# EAGLE schematic STM32f407layout_nonintegrated (EAGLE 7.5.0)
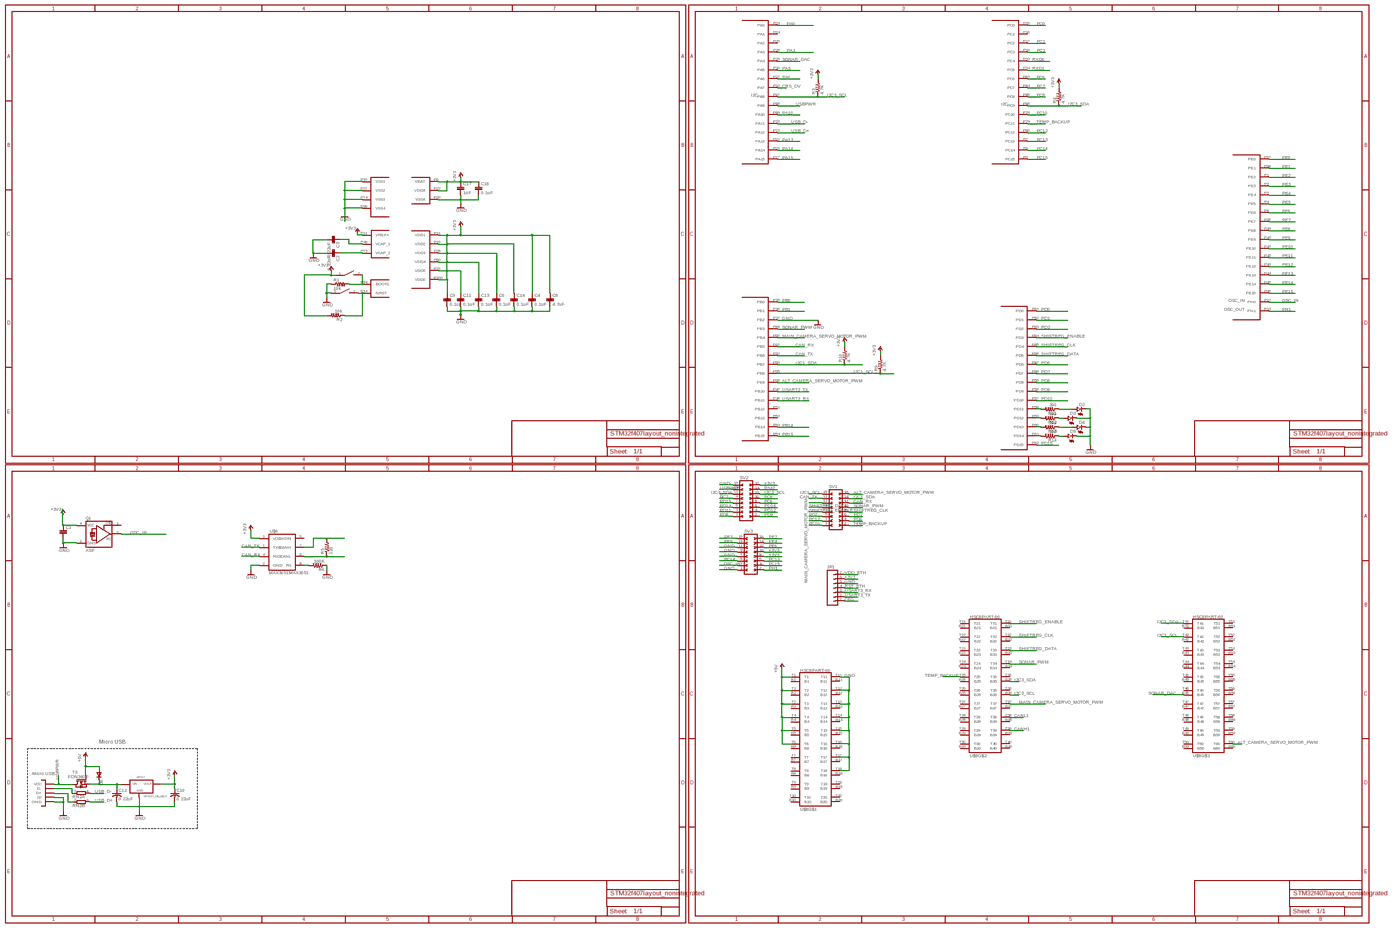
[diagram p0: schematic, sheet 1, overview]
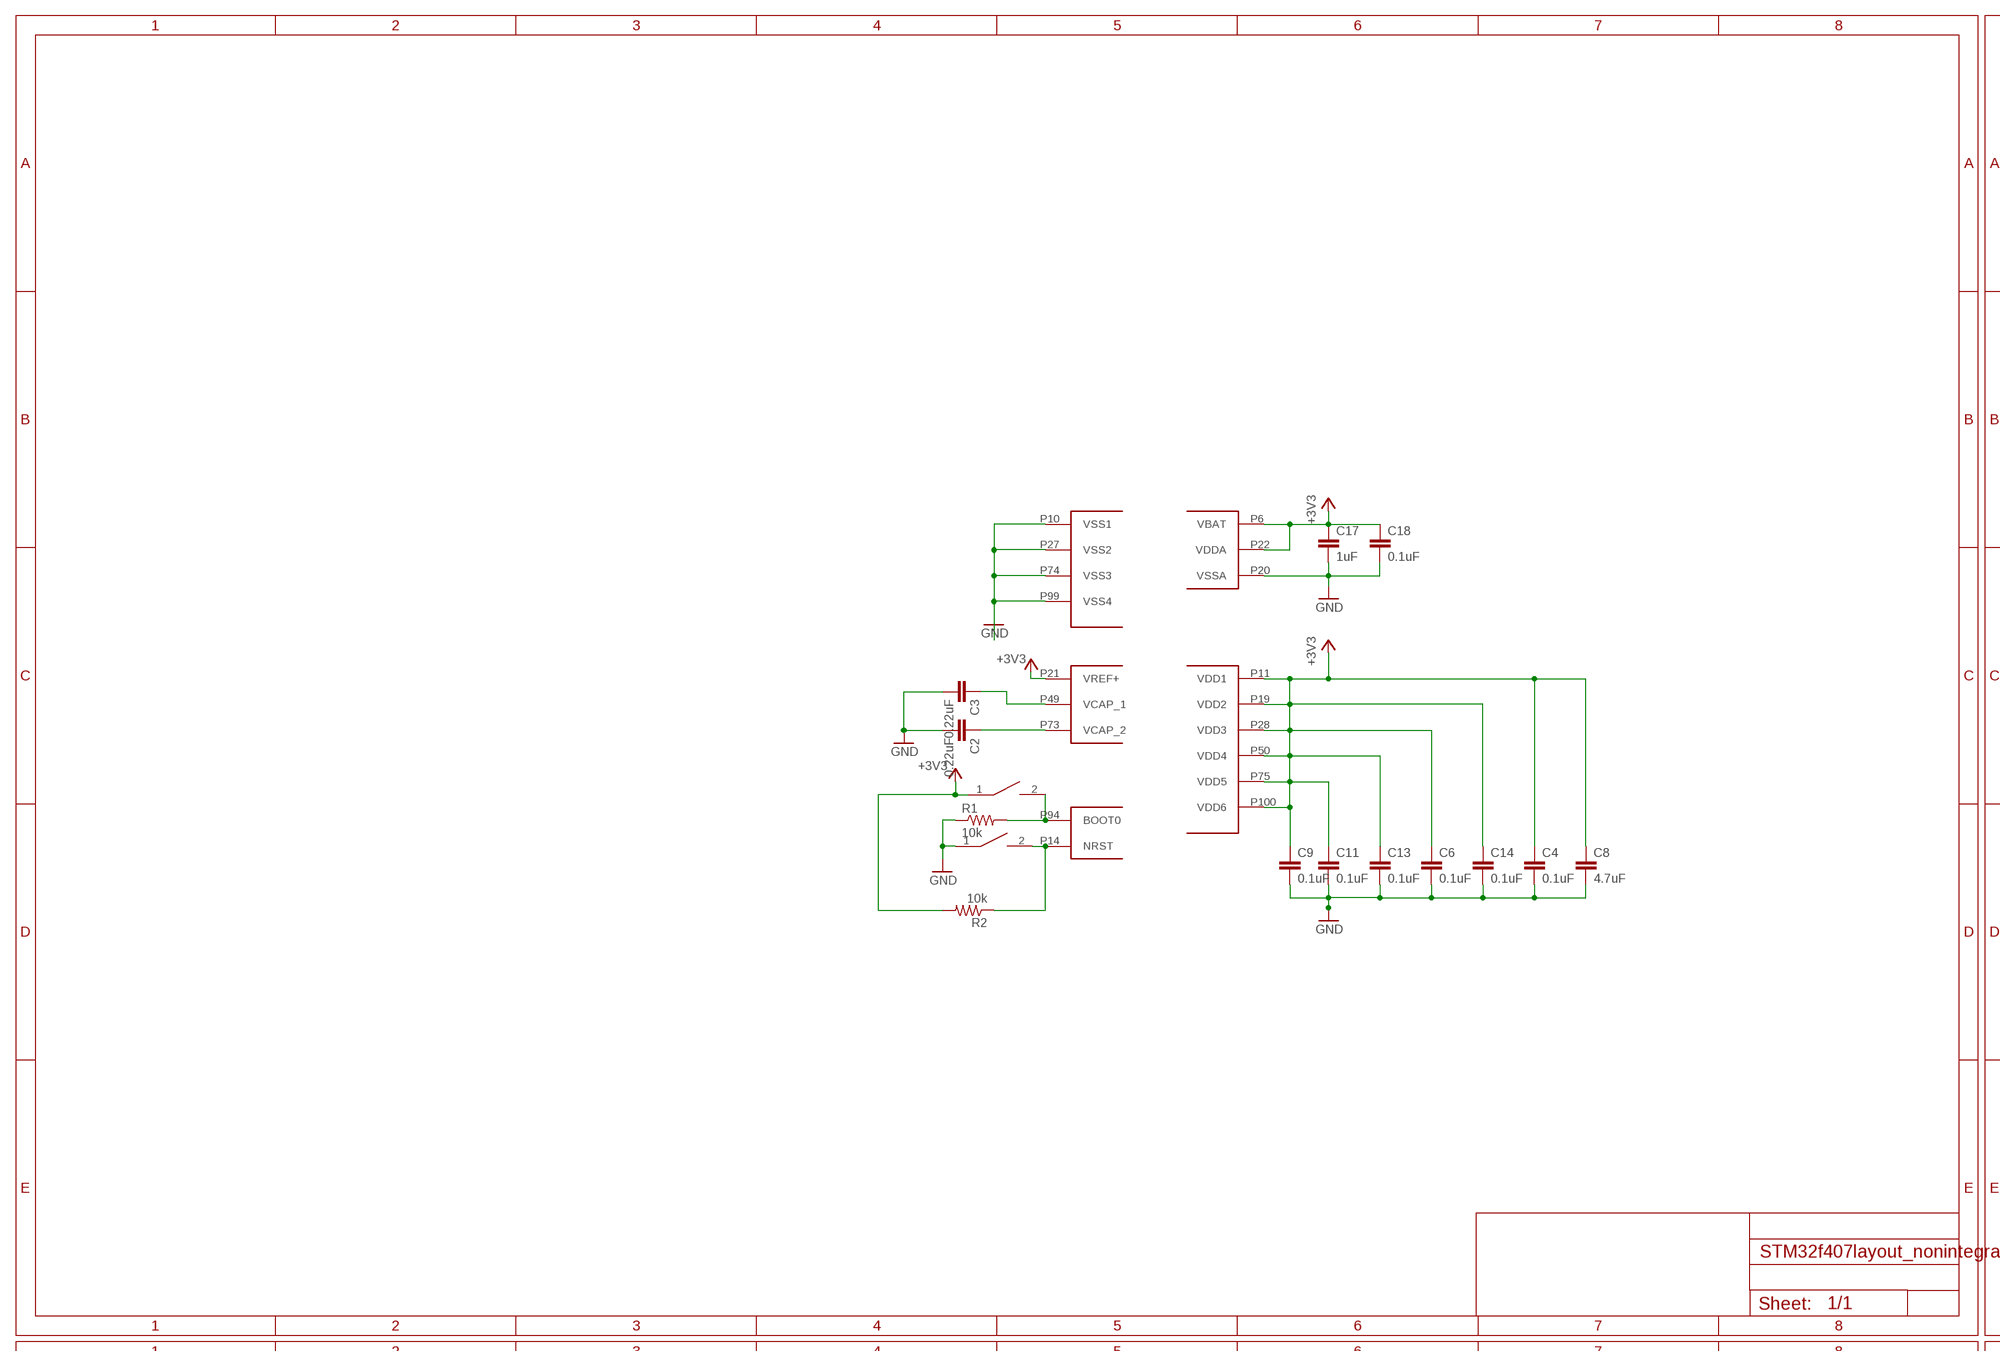
[diagram p1: schematic, sheet 1, part 1 of 4]
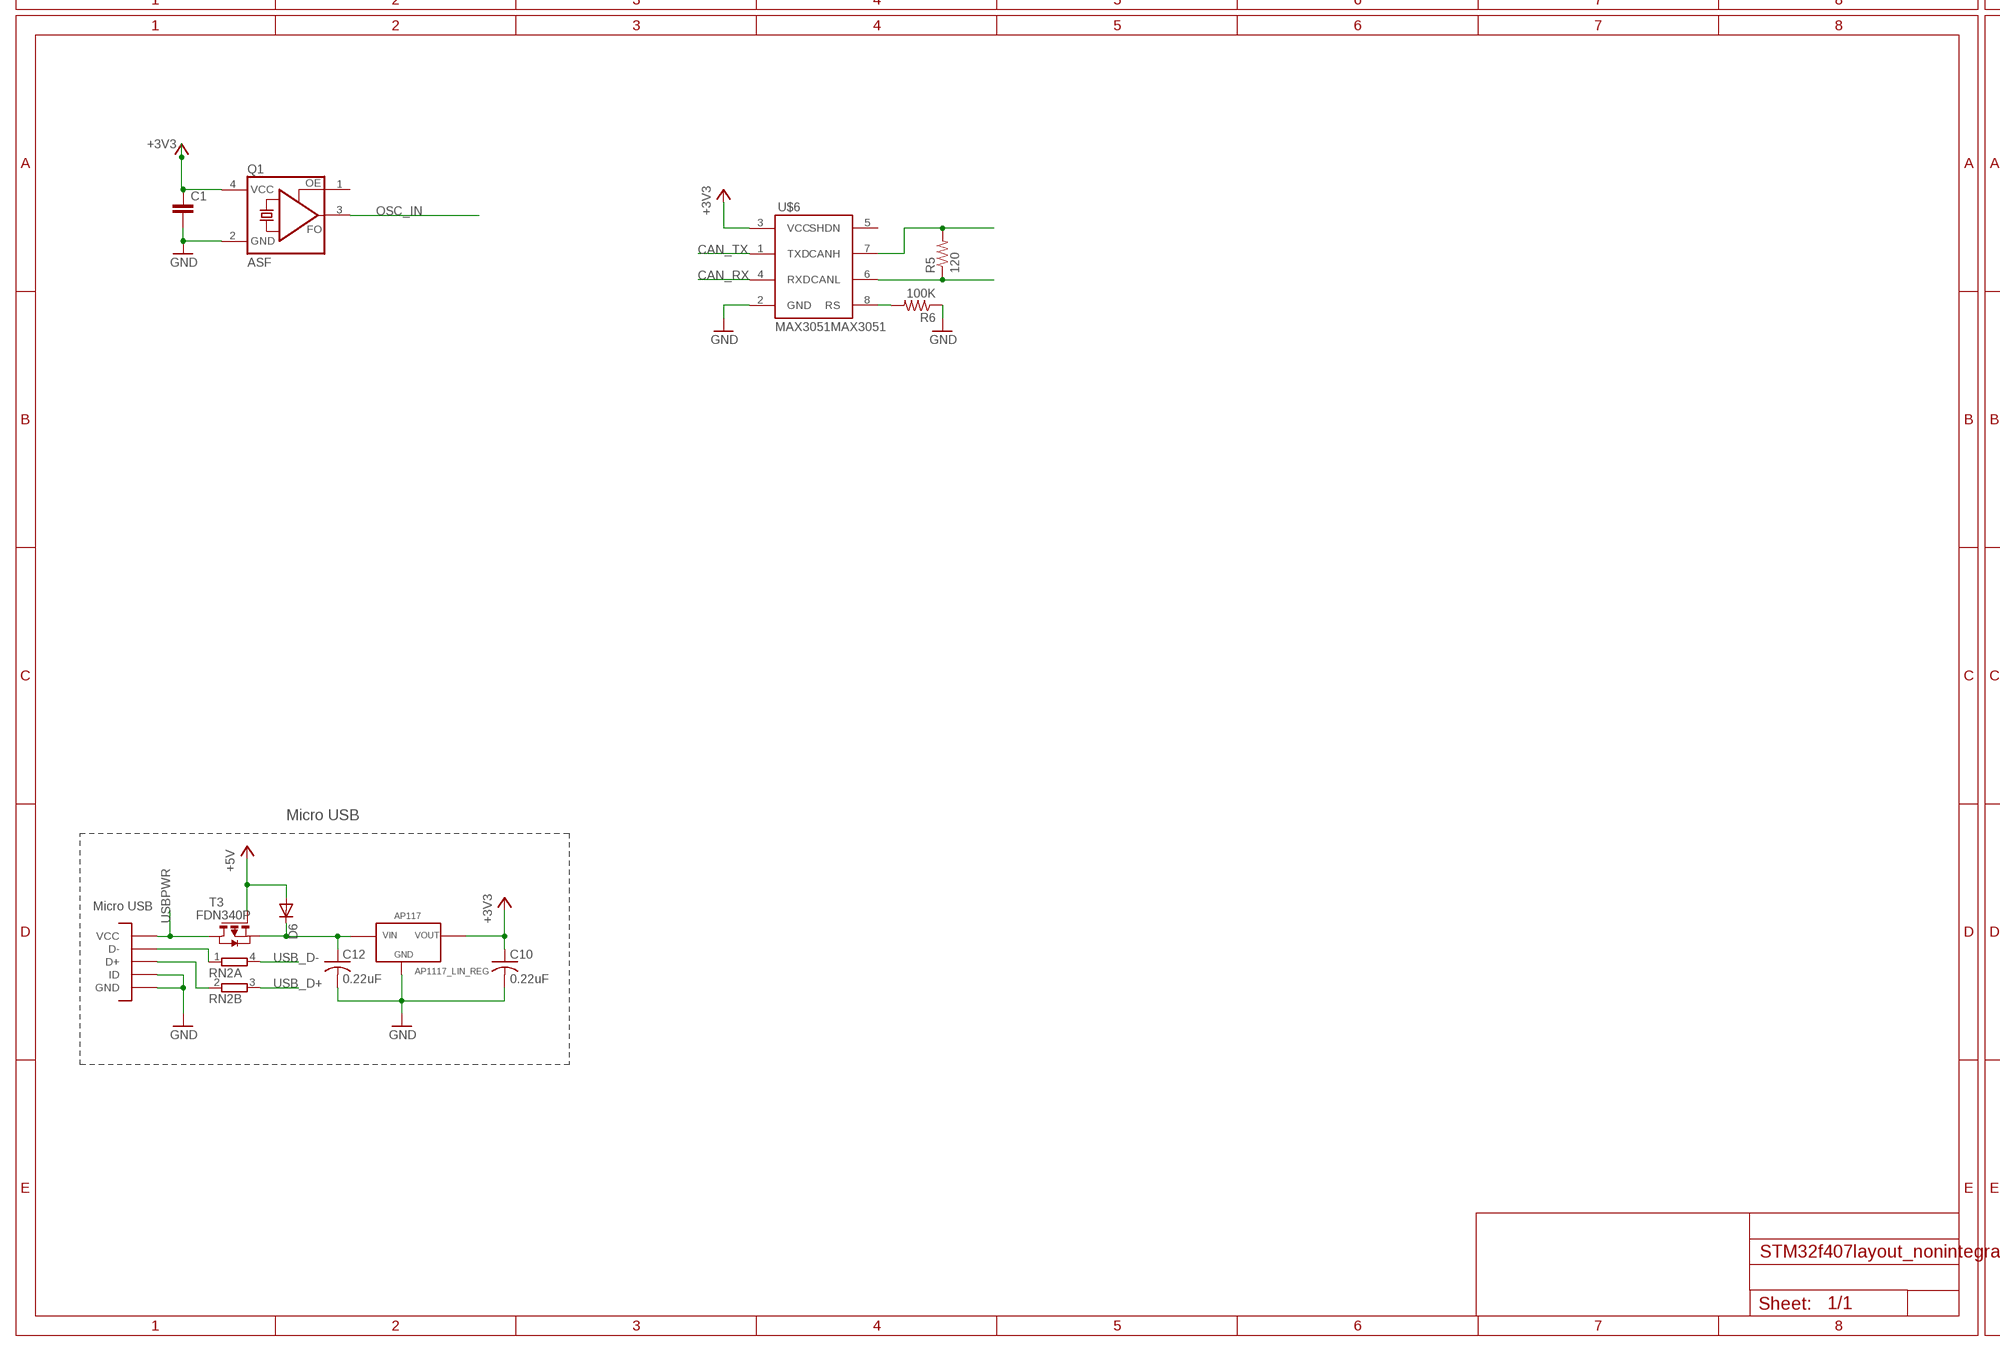
[diagram p2: schematic, sheet 1, part 2 of 4]
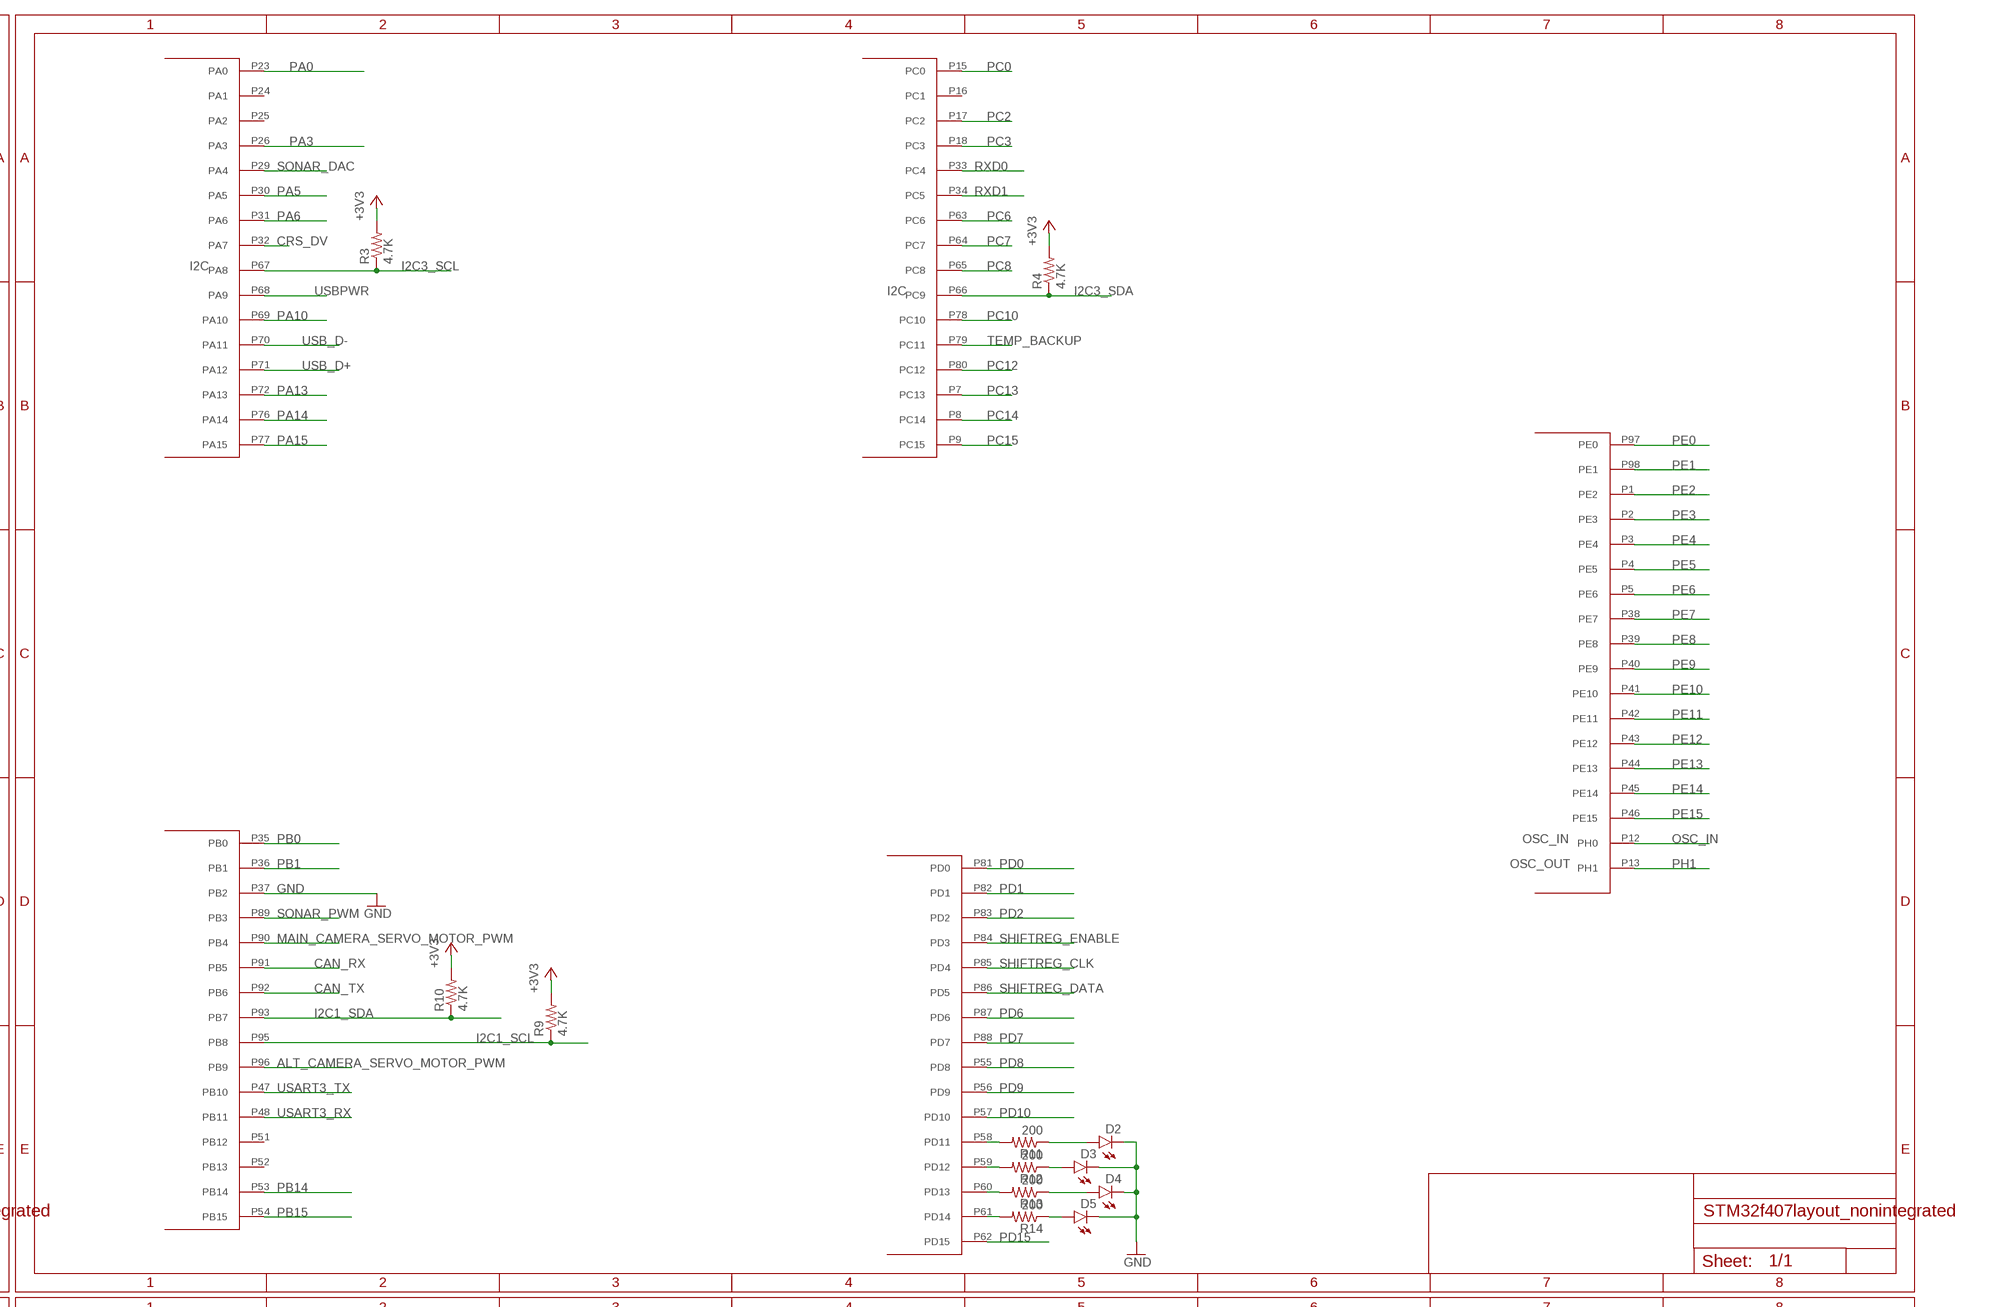
[diagram p3: schematic, sheet 1, part 3 of 4]
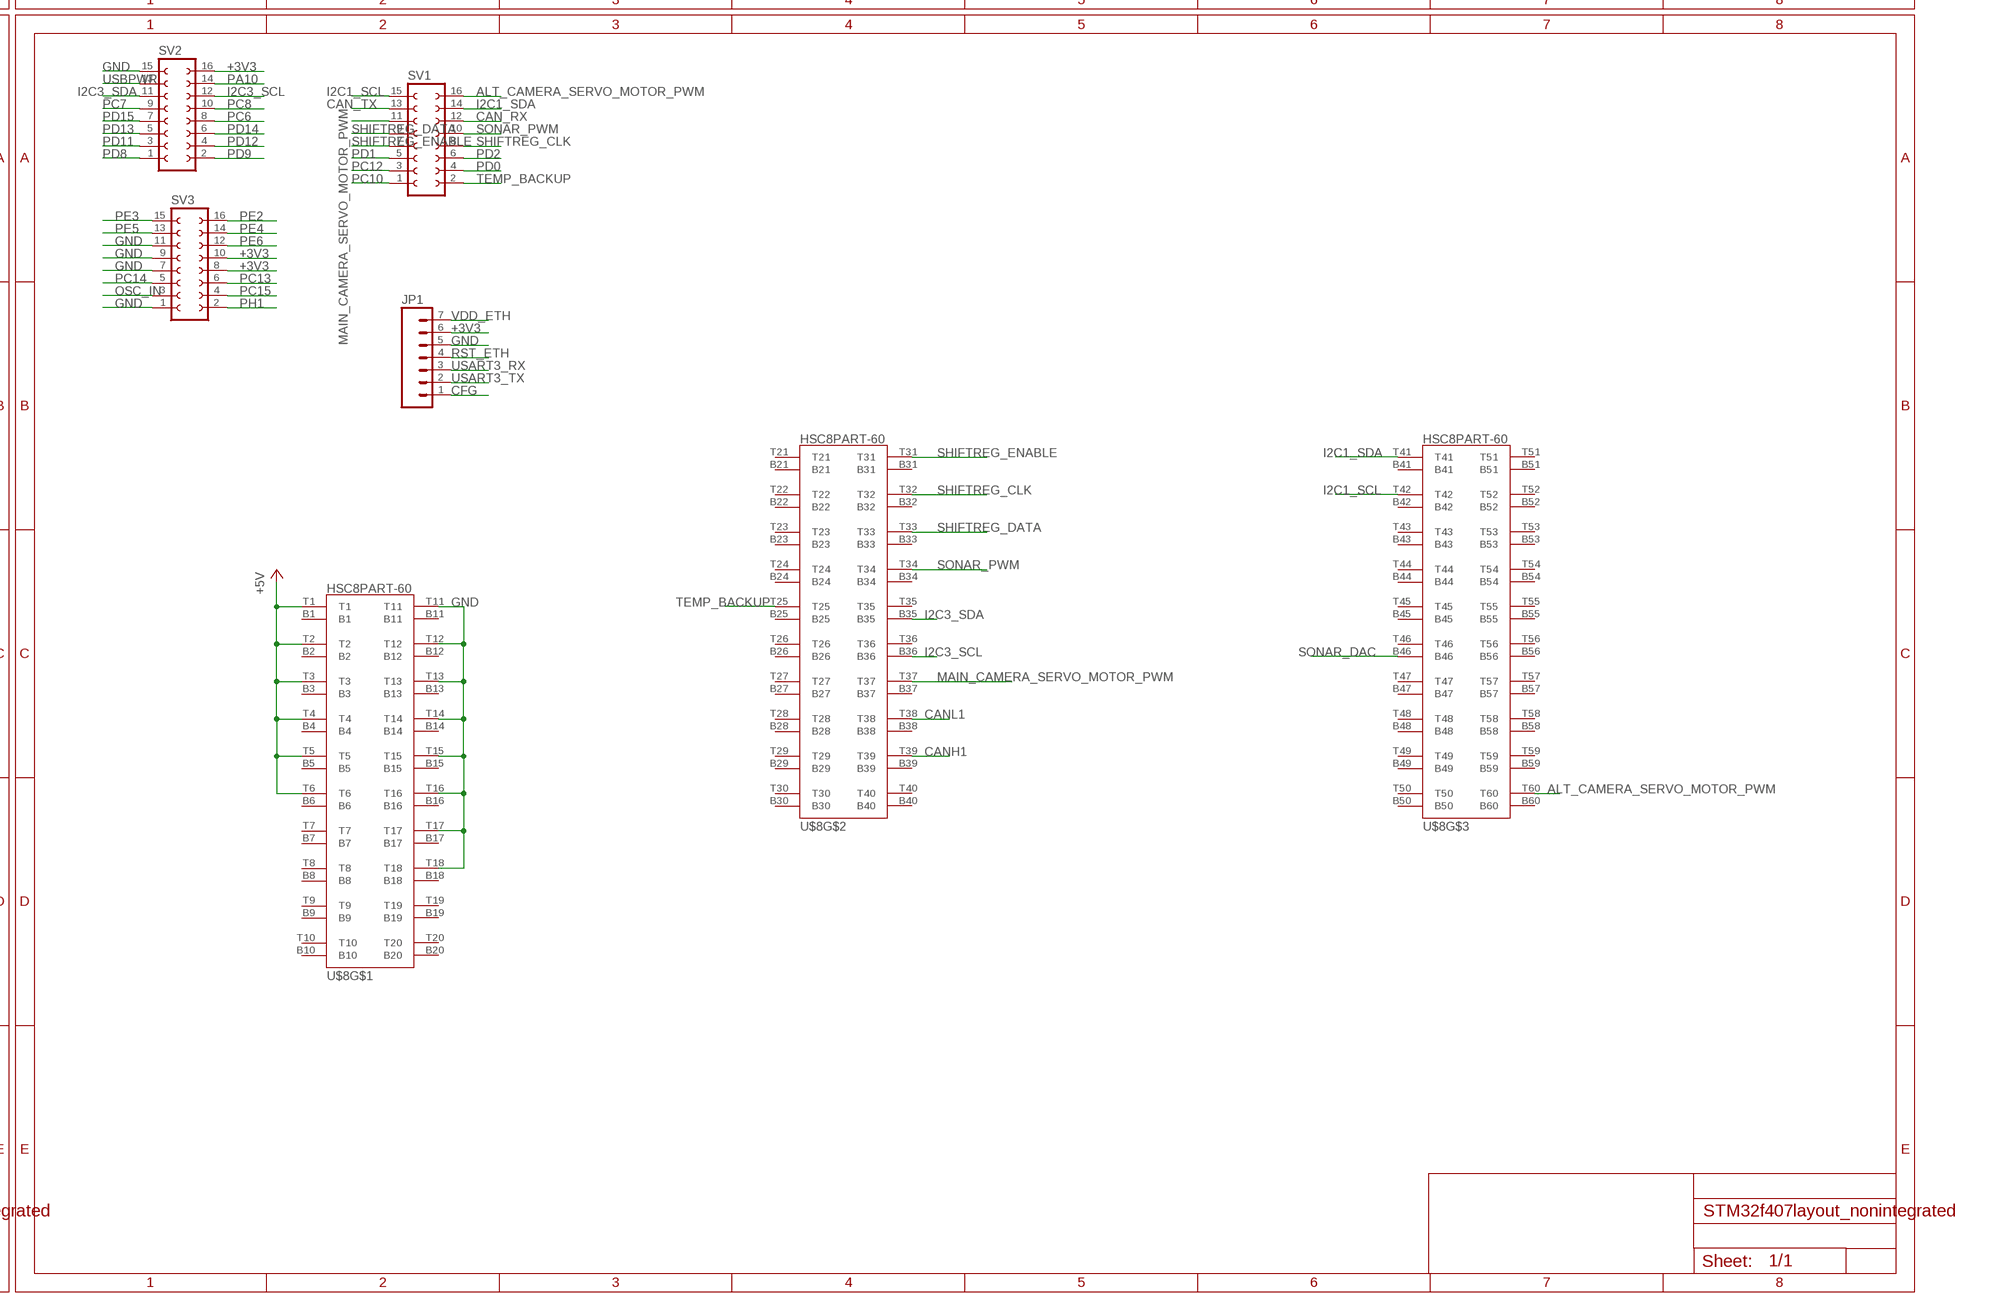
[diagram p4: schematic, sheet 1, part 4 of 4]

## Parts
C1  CAP0603-CAP  [0603-CAP]
C2  0.22uF  CAP0603-CAP  [0603-CAP]
C3  0.22uF  CAP0603-CAP  [0603-CAP]
C4  0.1uF  CAP0603-CAP  [0603-CAP]
C6  0.1uF  CAP0603-CAP  [0603-CAP]
C8  4.7uF  CAP0603-CAP  [0603-CAP]
C9  0.1uF  CAP0603-CAP  [0603-CAP]
C10  0.22uF  C-USC0603  [C0603]
C11  0.1uF  CAP0603-CAP  [0603-CAP]
C12  0.22uF  C-USC0603  [C0603]
C13  0.1uF  CAP0603-CAP  [0603-CAP]
C14  0.1uF  CAP0603-CAP  [0603-CAP]
C17  1uF  CAP0603-CAP  [0603-CAP]
C18  0.1uF  CAP0603-CAP  [0603-CAP]
D2  LED0603  [LED-0603]
D3  LED0603  [LED-0603]
D4  LED0603  [LED-0603]
D5  LED0603  [LED-0603]
D6  DIODE-DO-214AC  [DO-214AC]
JP1  M07  [1X07]
Q1  ASF  [ASF]
R1  10k  RESISTOR0603-RES  [0603-RES]
R2  10k  RESISTOR0603-RES  [0603-RES]
R3  4.7K  RESISTOR0603-RES  [0603-RES]
R4  4.7K  RESISTOR0603-RES  [0603-RES]
R5  120  RESISTOR0603-RES  [0603-RES]
R6  100K  RESISTOR0603-RES  [0603-RES]
R9  4.7K  RESISTOR0603-RES  [0603-RES]
R10  4.7K  RESISTOR0603-RES  [0603-RES]
R11  200  RESISTOR0603-RES  [0603-RES]
R12  200  RESISTOR0603-RES  [0603-RES]
R13  200  RESISTOR0603-RES  [0603-RES]
R14  200  RESISTOR0603-RES  [0603-RES]
RN2  2R-NEXBV4V  [EXBV4V]
SV1  FE08-2  [FE08-2]
SV2  FE08-2  [FE08-2]
SV3  FE08-2  [FE08-2]
T3  FDN340P  [SOT-23]
T4  AP1117_LIN_REG  [SOT223]
U$1  STM32F4  [LQFP100]
U$2  SWITCH  [SW_2512]
U$3  SWITCH  [SW_2512]
U$5  MICROUSB  [MICRO_B]
U$6  MAX3051MAX3051  [SOT23-8L]
U$8  HSC8PART-60  [HSC8-60PINOUUT]

## Nets
+3V3: C1.1 C4.1 C6.1 C8.1 C9.1 C10.1 C11.1 C13.1 C14.1 C17.1 C18.1 JP1.6 Q1.4(VCC) R2.2 R3.2 R4.2 R9.2 R10.2 SV2.16 SV3.8 SV3.10 T4.TAB(VOUT) T4.VOUT U$1.P6(VBAT) U$1.P11(VDD1) U$1.P19(VDD2) U$1.P21(VREF+) U$1.P22(VDDA) U$1.P28(VDD3) U$1.P50(VDD4) U$1.P75(VDD5) U$1.P100(VDD6) U$3.1 U$6.3(VCC)
+5V: D6.A T3.3(G) U$8.T1 U$8.T2 U$8.T3 U$8.T4 U$8.T5 U$8.T6
ALT_CAMERA_SERVO_MOTOR_PWM: SV1.16 U$1.P96(PB9) U$8.T60
CAN_RX: SV1.12 U$1.P91(PB5) U$6.4(RXD)
CAN_TX: SV1.13 U$1.P92(PB6) U$6.1(TXD)
CANH1: R5.2 U$6.7(CANH) U$8.T39
CANL1: R5.1 U$6.6(CANL) U$8.T38
CFG: JP1.1
CRS_DV: U$1.P32(PA7)
GND: C1.2 C2.2 C3.2 C4.2 C6.2 C8.2 C9.2 C10.2 C11.2 C12.2 C13.2 C14.2 C17.2 C18.2 D2.C D3.C D4.C D5.C JP1.5 Q1.2(GND) R1.1 R6.1 SV2.15 SV3.1 SV3.7 SV3.9 SV3.11 T4.GND U$1.P10(VSS1) U$1.P20(VSSA) U$1.P27(VSS2) U$1.P37(PB2) U$1.P74(VSS3) U$1.P99(VSS4) U$2.1 U$5.GND1(GND) U$5.GND2(GND) U$5.GND3(GND) U$5.GND4(GND) U$5.GND7(GND) U$5.GND8(GND) U$5.P4(ID) U$5.P5(GND) U$6.2(GND) U$8.T11 U$8.T12 U$8.T13 U$8.T14 U$8.T15 U$8.T16 U$8.T17 U$8.T18
I2C1_SCL: R9.1 SV1.15 U$1.P95(PB8) U$8.T42
I2C1_SDA: R10.1 SV1.14 U$1.P93(PB7) U$8.T41
I2C3_SCL: R3.1 SV2.12 U$1.P67(PA8) U$8.B36
I2C3_SDA: R4.1 SV2.11 U$1.P66(PC9) U$8.B35
MAIN_CAMERA_SERVO_MOTOR_PWM: SV1.11 U$1.P90(PB4) U$8.T37
N$1: C2.1 U$1.P73(VCAP_2)
N$2: C3.1 U$1.P49(VCAP_1)
N$3: R1.2 U$1.P94(BOOT0) U$3.2
N$4: R2.1 U$1.P14(NRST) U$2.2
N$11: R6.2 U$6.8(RS)
N$12: RN2.1 U$5.P2(D-)
N$14: D3.A R12.1
N$15: D5.A R14.1
N$17: D4.A R13.1
N$18: D2.A R11.1
N$24: RN2.2 U$5.P3(D+)
N$58: C12.1 D6.C T3.2(S) T4.VIN
OSC_IN: Q1.3(FO) SV3.3 U$1.P12(PH0)
PA0: U$1.P23(PA0)
PA3: U$1.P26(PA3)
PA5: U$1.P30(PA5)
PA6: U$1.P31(PA6)
PA10: SV2.14 U$1.P69(PA10)
PA13: U$1.P72(PA13)
PA14: U$1.P76(PA14)
PA15: U$1.P77(PA15)
PB0: U$1.P35(PB0)
PB1: U$1.P36(PB1)
PB14: U$1.P53(PB14)
PB15: U$1.P54(PB15)
PC0: U$1.P15(PC0)
PC2: U$1.P17(PC2)
PC3: U$1.P18(PC3)
PC6: SV2.8 U$1.P63(PC6)
PC7: SV2.9 U$1.P64(PC7)
PC8: SV2.10 U$1.P65(PC8)
PC10: SV1.1 U$1.P78(PC10)
PC12: SV1.3 U$1.P80(PC12)
PC13: SV3.6 U$1.P7(PC13)
PC14: SV3.5 U$1.P8(PC14)
PC15: SV3.4 U$1.P9(PC15)
PD0: SV1.4 U$1.P81(PD0)
PD1: SV1.5 U$1.P82(PD1)
PD2: SV1.6 U$1.P83(PD2)
PD6: U$1.P87(PD6)
PD7: U$1.P88(PD7)
PD8: SV2.1 U$1.P55(PD8)
PD9: SV2.2 U$1.P56(PD9)
PD10: U$1.P57(PD10)
PD11: R11.2 SV2.3 U$1.P58(PD11)
PD12: R12.2 SV2.4 U$1.P59(PD12)
PD13: R13.2 SV2.5 U$1.P60(PD13)
PD14: R14.2 SV2.6 U$1.P61(PD14)
PD15: SV2.7 U$1.P62(PD15)
PE0: U$1.P97(PE0)
PE1: U$1.P98(PE1)
PE2: SV3.16 U$1.P1(PE2)
PE3: SV3.15 U$1.P2(PE3)
PE4: SV3.14 U$1.P3(PE4)
PE5: SV3.13 U$1.P4(PE5)
PE6: SV3.12 U$1.P5(PE6)
PE7: U$1.P38(PE7)
PE8: U$1.P39(PE8)
PE9: U$1.P40(PE9)
PE10: U$1.P41(PE10)
PE11: U$1.P42(PE11)
PE12: U$1.P43(PE12)
PE13: U$1.P44(PE13)
PE14: U$1.P45(PE14)
PE15: U$1.P46(PE15)
PH1: SV3.2 U$1.P13(PH1)
RST_ETH: JP1.4
RXD0: U$1.P33(PC4)
RXD1: U$1.P34(PC5)
SHIFTREG_CLK: SV1.8 U$1.P85(PD4) U$8.T32
SHIFTREG_DATA: SV1.9 U$1.P86(PD5) U$8.T33
SHIFTREG_ENABLE: SV1.7 U$1.P84(PD3) U$8.T31
SONAR_DAC: U$1.P29(PA4) U$8.B46
SONAR_PWM: SV1.10 U$1.P89(PB3) U$8.T34
TEMP_BACKUP: SV1.2 U$1.P79(PC11) U$8.T25
USART3_RX: JP1.3 U$1.P48(PB11)
USART3_TX: JP1.2 U$1.P47(PB10)
USB_D+: RN2.3 U$1.P71(PA12)
USB_D-: RN2.4 U$1.P70(PA11)
USBPWR: SV2.13 T3.1(D) U$1.P68(PA9) U$5.P1(VCC)
VDD_ETH: JP1.7
Unconnected: Q1.1(OE) U$1.P16(PC1) U$1.P24(PA1) U$1.P25(PA2) U$1.P51(PB12) U$1.P52(PB13) U$6.5(SHDN) U$8.B1 U$8.B2 U$8.B3 U$8.B4 U$8.B5 U$8.B6 U$8.B7 U$8.B8 U$8.B9 U$8.B10 U$8.B11 U$8.B12 U$8.B13 U$8.B14 U$8.B15 U$8.B16 U$8.B17 U$8.B18 U$8.B19 U$8.B20 U$8.B21 U$8.B22 U$8.B23 U$8.B24 U$8.B25 U$8.B26 U$8.B27 U$8.B28 U$8.B29 U$8.B30 U$8.B31 U$8.B32 U$8.B33 U$8.B34 U$8.B37 U$8.B38 U$8.B39 U$8.B40 U$8.B41 U$8.B42 U$8.B43 U$8.B44 U$8.B45 U$8.B47 U$8.B48 U$8.B49 U$8.B50 U$8.B51 U$8.B52 U$8.B53 U$8.B54 U$8.B55 U$8.B56 U$8.B57 U$8.B58 U$8.B59 U$8.B60 U$8.T7 U$8.T8 U$8.T9 U$8.T10 U$8.T19 U$8.T20 U$8.T21 U$8.T22 U$8.T23 U$8.T24 U$8.T26 U$8.T27 U$8.T28 U$8.T29 U$8.T30 U$8.T35 U$8.T36 U$8.T40 U$8.T43 U$8.T44 U$8.T45 U$8.T46 U$8.T47 U$8.T48 U$8.T49 U$8.T50 U$8.T51 U$8.T52 U$8.T53 U$8.T54 U$8.T55 U$8.T56 U$8.T57 U$8.T58 U$8.T59

## Notes on the sheet
- I2C
- I2C
- Micro USB
- Micro USB

## Library data of the parts
C1-C4 C6 C8 C9 C11 C13 C14 C17 C18 = SparkFun-Passives:CAP: Capacitor Standard 0603 ceramic capacitor, and 0.1" leaded capacitor.
C10 C12 = rcl:C-US: CAPACITOR, American symbol
D2-D5 = SparkFun-LED:LED: LEDs Standard schematic elements and footprints for 5mm, 3mm, 1206, and 0603 sized LEDs. 5mm - Spark Fun Electronics SKU : COM-00529 (and others)
D6 = DiscreteComponents:DIODE-: DIODE
JP1 = Connectors:M07: Header 7 Standard 7-pin 0.1" header. Use with straight break away headers (SKU : PRT-00116), right angle break away headers (PRT-00553), swiss pins (PRT-00743), machine pins (PRT-00117), and female headers (PRT-00115). NOTES ON THE VARIANTS LOCK and LOCK_LONGPADS... This footprint was designed to help hold the alignment of a through-hole component (i.e. 7-pin header) while soldering it into place. You may notice that each hole has been shifted either up or down by 0.005 of an inch from it's more standard position (which is usually a perfectly straight line). This slight alteration caused the pins (the squares in the middle) to touch the edges of the holes. Because they are alternating, it causes a "brace" to hold the header in place. 0.005 has proven to be the perfect amount of "off-center" position when using our standard breakaway headers. Although looks a little odd when you look at the bare footprint, once you have a header in there, the alteration is very hard to notice. Also, if you push a header all the way into place, it is covered up entirely on the bottom side. This idea of altering the position of holes to aid alignment will be further integrated into the Sparkfun Library for other footprints. It can help hold any component with 3 or more connection pins.
Q1 = DiscreteComponents:ASF*: CRYSTAL CLOCK OSCILLATORS 5.0 Vdc or 3.3 Vdc - LOW PROFILE ULTRA MINIATURE CERAMIC SURFACE MOUNT Source: http://www.abracon.com/Oscillators/asf1-L-L1.pdf; DIGIKEY: 535-10066-1-ND
R1-R6 R9-R14 = SparkFun-Passives:RESISTOR: Resistor Basic schematic elements and footprints for 0603, 1206, and PTH resistors.
RN2 = DiscreteComponents:2R-N: Array Chip Resistor; DIGIKEY: RHM1381CT-ND; MF: Rohm Semiconductor; MPN: MNR12ERAPJ220
SV1-SV3 = con-lsta:FE08-2: FEMALE HEADER; OC_FARNELL: unknown; OC_NEWARK: unknown
T3 = DiscreteComponents:FDN340P: MOS FET; DIGIKEY: FDN340PCT-ND
T4 = PowerComponents:AP1117_LIN_REG
U$1 = Other:STM32F4
U$2 U$3 = DiscreteComponents:SWITCH
U$5 = Other:MICROUSB
U$6 = MAX3051 Library:MAX3051: Maxim Integrated MAX3051 CAN Tranciever
U$8 = Connectors:HSC8PART-60

## Net classes
1 DiffPair: width 0.254 mm